# EAGLE design facewhisperer (EAGLE 6.6.0)
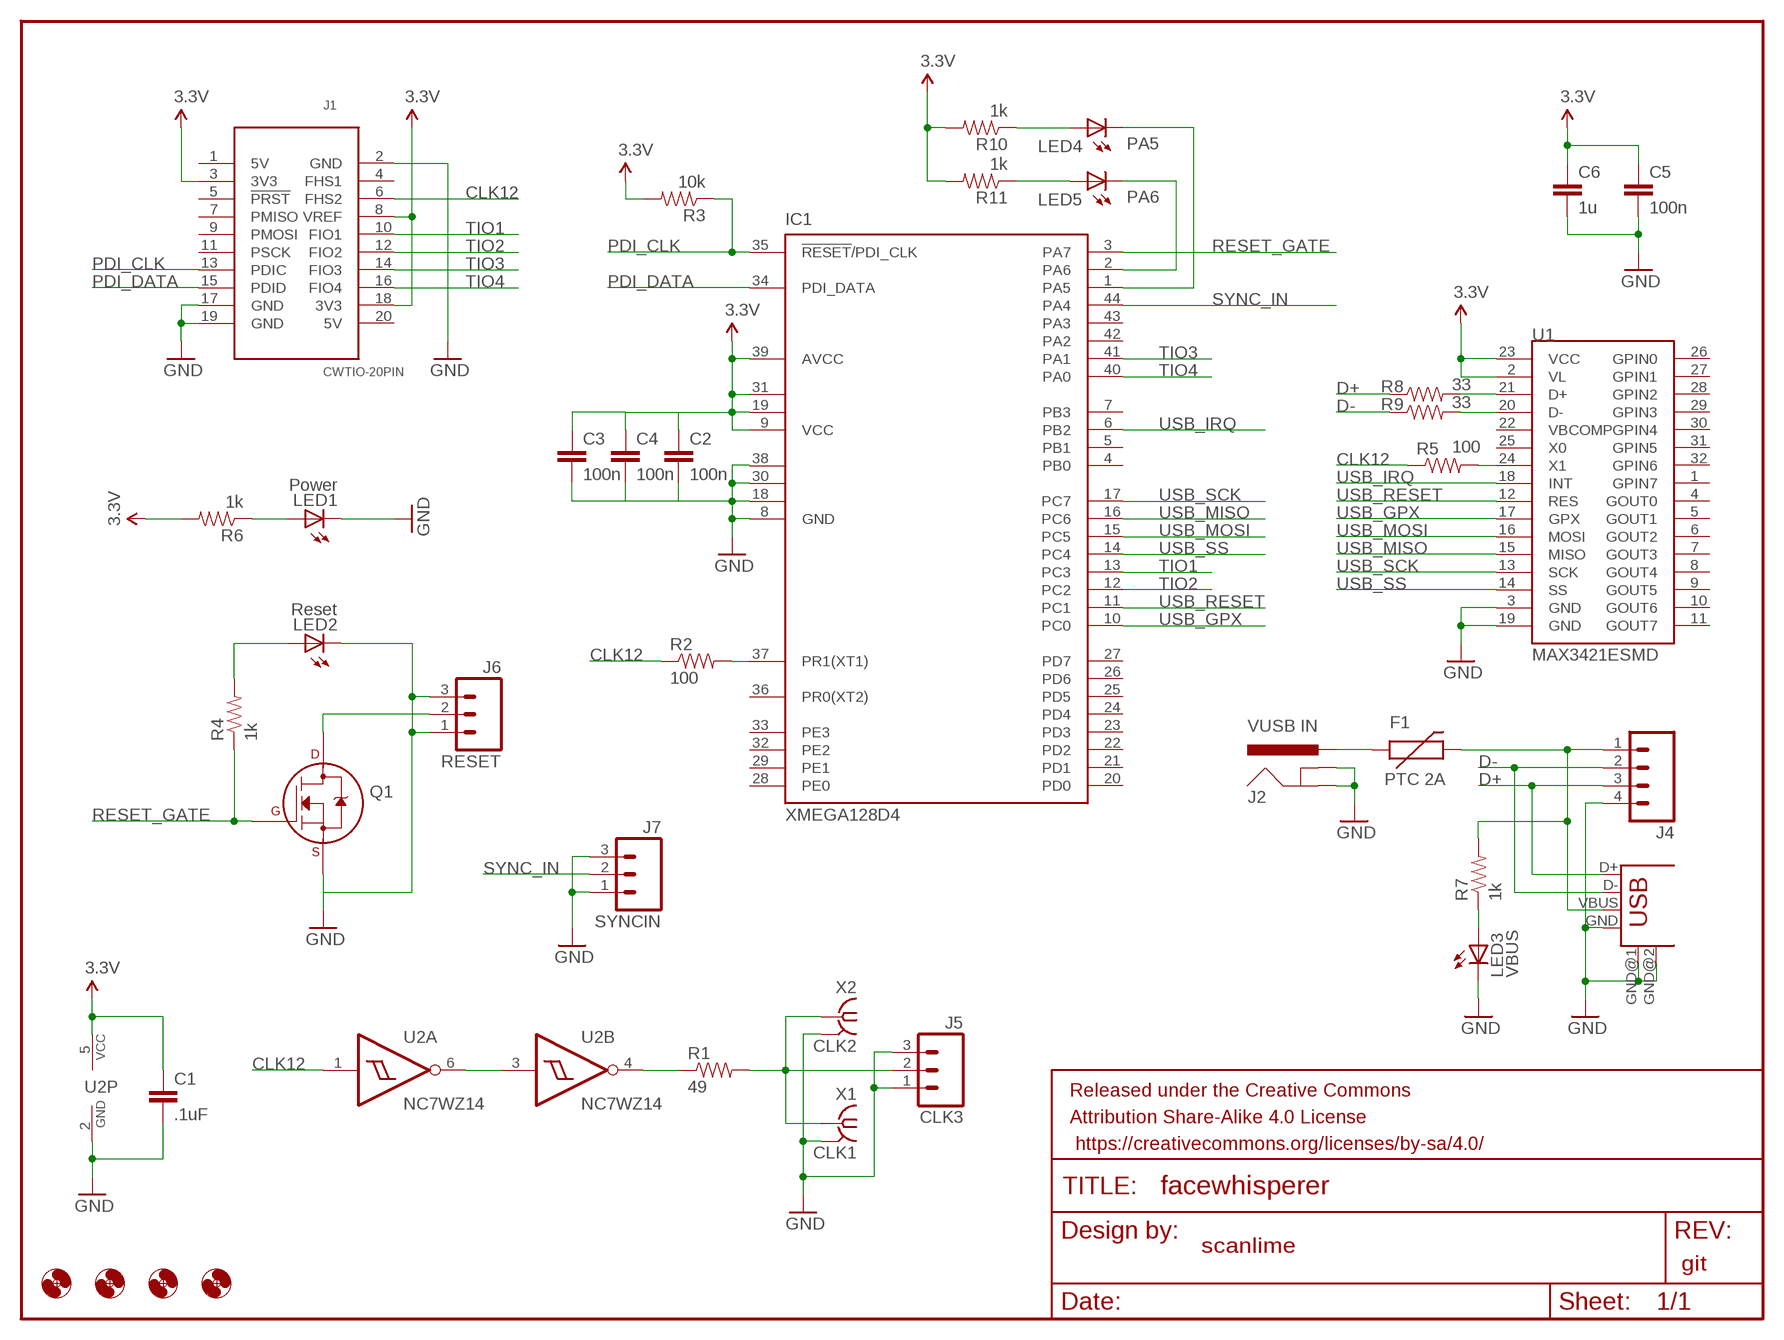
[diagram p0: schematic, sheet 1]

## Parts
C1  .1uF  CAP0805  [0805]
C2  100n  CAP0805  [0805]
C3  100n  CAP0805  [0805]
C4  100n  CAP0805  [0805]
C5  100n  CAP0805  [0805]
C6  1u  CAP0805  [0805]
F1  PTC 2A  PTCSMD-W  [PTC-1206-WIDE]
FRAME1  FRAME-LETTERNO_PACKAGE  [DUMMY]
H1  MOUNT-HOLE3.2  [3,2]
H2  MOUNT-HOLE3.2  [3,2]
H3  MOUNT-HOLE3.2  [3,2]
H4  MOUNT-HOLE3.2  [3,2]
IC1  XMEGA128D4  XMEGA16A4A  [TQFP44]
J1  CWTIO-20PIN  [PINSHRD_PTH_2X10]
J2  VUSB IN  POWER_JACKPTH  [POWER_JACK_PTH]
J3  USB-A-H  [USB-A-H]
J4  M04LOCK_LONGPADS  [1X04_LOCK_LONGPADS]
J5  CLK3  M03LOCK_LONGPADS  [1X03_LOCK_LONGPADS]
J6  RESET  M03LOCK_LONGPADS  [1X03_LOCK_LONGPADS]
J7  SYNCIN  M03LOCK_LONGPADS  [1X03_LOCK_LONGPADS]
LED1  Power  LEDSMT1206  [1206]
LED2  Reset  LEDSMT1206  [1206]
LED3  VBUS  LEDSMT1206  [1206]
LED4  PA5  LEDSMT1206  [1206]
LED5  PA6  LEDSMT1206  [1206]
Q1  2N7002_SOT23  [SOT-23]
R1  49  RESISTOR0805-RES  [0805]
R2  100  RESISTOR0805-RES  [0805]
R3  10k  RESISTOR0805-RES  [0805]
R4  1k  RESISTOR0805-RES  [0805]
R5  100  RESISTOR0805-RES  [0805]
R6  1k  RESISTOR0805-RES  [0805]
R7  1k  RESISTOR0805-RES  [0805]
R8  33  RESISTOR0805-RES  [0805]
R9  33  RESISTOR0805-RES  [0805]
R10  1k  RESISTOR0805-RES  [0805]
R11  1k  RESISTOR0805-RES  [0805]
U1  MAX3421ESMD  [TQFP32-5MM-MILLABLE]
U2  NC7WZ14  [SC70-6-MILLABLE]
X1  CLK1  SMA-NOSILK  [J502-ND-142-0711-821/826-NOSILK]
X2  CLK2  SMA-NOSILK  [J502-ND-142-0711-821/826-NOSILK]

## Nets
3.3V: C1.1 C2.1 C3.1 C4.1 C5.1 C6.1 IC1.9(VCC) IC1.19(VCC1) IC1.31(VCC2) IC1.39(AVCC) J1.3(3V3) J1.8(VREF) J1.18(3V3) R3.2 R6.2 R10.2 R11.2 U1.2(VL) U1.23(VCC) U2.5(P:VCC)
CLK12: J1.6(FHS2) R2.1 R5.1 U2.1(A:IN)
D+: J3.D+ J4.3 R8.1
D-: J3.D- J4.2 R9.1
GND: C1.2 C2.2 C3.2 C4.2 C5.2 C6.2 IC1.8(GND) IC1.18(GND1) IC1.30(GND2) IC1.38(GND3) J1.2(GND) J1.17(GND) J1.19(GND) J2.GND J2.GNDBREAK J3.GND J3.GND@1(GND) J3.GND@2(GND) J4.4 J5.1 J5.3 J6.1 J6.3 J7.1 J7.3 LED1.C LED2.C LED3.C Q1.2(S) U1.3(GND) U1.19(GND) U2.2(P:GND) X1.G@1 X1.G@2 X1.G@3 X1.G@4 X2.G@1 X2.G@2 X2.G@3 X2.G@4
N$1: U2.3(B:IN) U2.6(A:OUT)
N$2: R1.1 U2.4(B:OUT)
N$3: J5.2 R1.2 X1.1 X2.1
N$4: R5.2 U1.24(X1)
N$5: F1.2 J3.VBUS J4.1 R7.2
N$6: LED2.A R4.2
N$7: IC1.37(PR1(XT1)) R2.2
N$8: J6.2 Q1.3(D)
N$9: LED1.A R6.1
N$10: LED3.A R7.1
N$11: R9.2 U1.20(D-)
N$12: R8.2 U1.21(D+)
N$13: F1.1 J2.PWR
N$14: LED4.A R10.1
N$15: LED5.A R11.1
N$16: IC1.2(PA6) LED5.C
N$17: IC1.1(PA5) LED4.C
PDI_CLK: IC1.35(!RESET!/PDI_CLK) J1.13(PDIC) R3.1
PDI_DATA: IC1.34(PDI_DATA) J1.15(PDID)
RESET_GATE: IC1.3(PA7) Q1.1(G) R4.1
SYNC_IN: IC1.44(PA4) J7.2
TIO1: IC1.13(PC3) J1.10(FIO1)
TIO2: IC1.12(PC2) J1.12(FIO2)
TIO3: IC1.41(PA1) J1.14(FIO3)
TIO4: IC1.40(PA0) J1.16(FIO4)
USB_GPX: IC1.10(PC0) U1.17(GPX)
USB_IRQ: IC1.6(PB2) U1.18(INT)
USB_MISO: IC1.16(PC6) U1.15(MISO)
USB_MOSI: IC1.15(PC5) U1.16(MOSI)
USB_RESET: IC1.11(PC1) U1.12(RES)
USB_SCK: IC1.17(PC7) U1.13(SCK)
USB_SS: IC1.14(PC4) U1.14(SS)
Unconnected: IC1.4(PB0) IC1.5(PB1) IC1.7(PB3) IC1.20(PD0) IC1.21(PD1) IC1.22(PD2) IC1.23(PD3) IC1.24(PD4) IC1.25(PD5) IC1.26(PD6) IC1.27(PD7) IC1.28(PE0) IC1.29(PE1) IC1.32(PE2) IC1.33(PE3) IC1.36(PR0(XT2)) IC1.42(PA2) IC1.43(PA3) J1.1(5V) J1.4(FHS1) J1.5(!PRST) J1.7(PMISO) J1.9(PMOSI) J1.11(PSCK) J1.20(5V) U1.1(GPIN7) U1.4(GOUT0) U1.5(GOUT1) U1.6(GOUT2) U1.7(GOUT3) U1.8(GOUT4) U1.9(GOUT5) U1.10(GOUT6) U1.11(GOUT7) U1.22(VBCOMP) U1.25(X0) U1.26(GPIN0) U1.27(GPIN1) U1.28(GPIN2) U1.29(GPIN3) U1.30(GPIN4) U1.31(GPIN5) U1.32(GPIN6)

## Notes on the sheet
- scanlime
- git

## Library data of the parts
C1-C6 = SparkFun-Passives:CAP: Capacitor Standard 0603 ceramic capacitor, and 0.1" leaded capacitor.
F1 = SparkFun-PowerIC:PTC: Resettable Fuse PTC Resettable Fuse. Spark Fun Electronics SKU : COM-08357
FRAME1 = SparkFun-Aesthetics:FRAME-LETTER: Schematic Frame Standard 8.5x11 US Letter frame; DESIGNER: Nobody; VERSION: v01
H1-H4 = holes:MOUNT-HOLE: MOUNTING HOLE with drill center marker
IC1 = atmel:XMEGA16A4: MICROCONTROLLER Features High-performance, Low-power 8/16-bit AVR XMEGA Microcontroller Non-Volatile Program and Data Memories - 16 KB - 128 KB of In-System Self-Programmable Flash - 4 KB - 8 KB Boot Code Section with Independent Lock Bits - 1 KB - 2 KB EEPROM - 2 KB - 8 KB Internal SRAM Peripheral Features - Four-channel DMA Controller with support for external requests - Eight-channel Event System - Five 16-bit Timer/Counters Three Timer/Counters with 4 Output Compare or Input Capture channels Two Timer/Counters with 2 Output Compare or Input Capture channels High-Resolution Extensions on all Timer/Counters Advanced Waveform Extension on one Timer/Counter - Five USARTs IrDA Extension on one USART - Two Two-Wire Interfaces with dual address match (I2C and SMBus compatible) - Two SPIs (Serial Peripheral Interfaces) peripherals - AES and DES Crypto Engine - 16-bit Real Time Counter with Separate Oscillator - One Twelve-channel, 12-bit, 2 Msps Analog to Digital Converter - One Two-channel, 12-bit, 1 Msps Digital to Analog Converter - Two Analog Comparators with Window compare function - External Interrupts on all General Purpose I/O pins - Programmable Watchdog Timer with Separate On-chip Ultra Low Power Oscillator Special Microcontroller Features - Power-on Reset and Programmable Brown-out Detection - Internal and External Clock Options with PLL - Programmable Multi-level Interrupt Controller - Sleep Modes: Idle, Power-down, Standby, Power-save, Extended Standby - Advanced Programming, Test and Debugging Interfaces PDI (Program and Debug Interface) for programming, test and debugging I/O and Packages - 34 Programmable I/O Lines - 44 - lead TQFP - 44 - pad VQFN/QFN - 49 - ball VFBGA Operating Voltage - 1.6 - 3.6V Speed performance - 0 - 12 MHz @ 1.6 - 3.6V - 0 - 32 MHz @ 2.7 - 3.6V Drawn by Dipl.-Ing. (FH) Robert Siegler Created: 27.05.09; OC_FARNELL: unknown; OC_NEWARK: unknown
J1 = chipwhisperer:CWTIO-20PIN
J2 = SparkFun-Connectors:POWER_JACK: Power Jack This is the standard 5.5mm barrel jack for power. The PTH is the most common, proven, reliable, footprint. The Slot footprint only works if the mill layer is transmitted to the PCB fab house so be warned. Mating wall wart : TOL-00298 (and others); PROD_ID: CONN-08197
J3 = con-usb-2:USB: USB Connectors
J4 = SparkFun-Connectors:M04: Header 4 Standard 4-pin 0.1" header. Use with straight break away headers (SKU : PRT-00116), right angle break away headers (PRT-00553), swiss pins (PRT-00743), machine pins (PRT-00117), and female headers (PRT-00115). Molex polarized connector foot print use with SKU : PRT-08231 with associated crimp pins and housings. 1MM SMD Version SKU: PRT-10208; PROD_ID: CONN-09696
J5-J7 = SparkFun-Connectors:M03: Header 3 Standard 3-pin 0.1" header. Use with straight break away headers (SKU : PRT-00116), right angle break away headers (PRT-00553), swiss pins (PRT-00743), machine pins (PRT-00117), and female headers (PRT-00115). Molex polarized connector foot print use with SKU : PRT-08232 with associated crimp pins and housings.
LED1-LED5 = adafruit:LED: LED OSRAM: - CHIPLED LG R971, LG N971, LY N971, LG Q971, LY Q971, LO R971, LY R971 LH N974, LH R974 LS Q976, LO Q976, LY Q976 LO Q996 - Hyper CHIPLED LW Q18S LB Q993, LB Q99A, LB R99A - SideLED LS A670, LO A670, LY A670, LG A670, LP A670 LB A673, LV A673, LT A673, LW A673 LH A674 LY A675 LS A676, LA A676, LO A676, LY A676, LW A676 LS A679, LY A679, LG A679 - Hyper Micro SIDELED® LS Y876, LA Y876, LO Y876, LY Y876 LT Y87S - SmartLED LW L88C, LW L88S LB L89C, LB L89S, LG L890 LS L89K, LO L89K, LY L89K LS L896, LA L896, LO L896, LY L896 - TOPLED LS T670, LO T670, LY T670, LG T670, LP T670 LSG T670, LSP T670, LSY T670, LOP T670, LYG T670 LG T671, LOG T671, LSG T671 LB T673, LV T673, LT T673, LW T673 LH T674 LS T676, LA T676, LO T676, LY T676, LB T676, LH T676, LSB T676, LW T676 LB T67C, LV T67C, LT T67C, LS T67K, LO T67K, LY T67K, LW E67C LS E67B, LA E67B, LO E67B, LY E67B, LB E67C, LV E67C, LT E67C LW T67C LS T679, LY T679, LG T679 LS T770, LO T770, LY T770, LG T770, LP T770 LB T773, LV T773, LT T773, LW T773 LH T774 LS E675, LA E675, LY E675, LS T675 LS T776, LA T776, LO T776, LY T776, LB T776 LHGB T686 LT T68C, LB T68C - Hyper Mini TOPLED® LB M676 - Mini TOPLED Santana® LG M470 LS M47K, LO M47K, LY M47K Source: http://www.osram.convergy.de/
Q1 = transistors:2N700*: 2N7000, 2N7002, NDS7002A N-channel enhancement mode MOSFET
R1-R11 = SparkFun-Passives:RESISTOR: Resistor Basic schematic elements and footprints for 0603, 1206, and PTH resistors.
U1 = SparkFun-DigitalIC:MAX3421E: USB Peripheral/Host Controller w/ SPI
U2 = fairchild-semi:NC7WZ14: UHS Dual Inverter with Schmitt Trigger
X1 X2 = custom-std:SMA-: SMA 50 Ohm End Launch Jack Receptacle - Round Contact Johnson Components Source: www.johnsoncomponents.com .. J502-ND.pdf

## Board
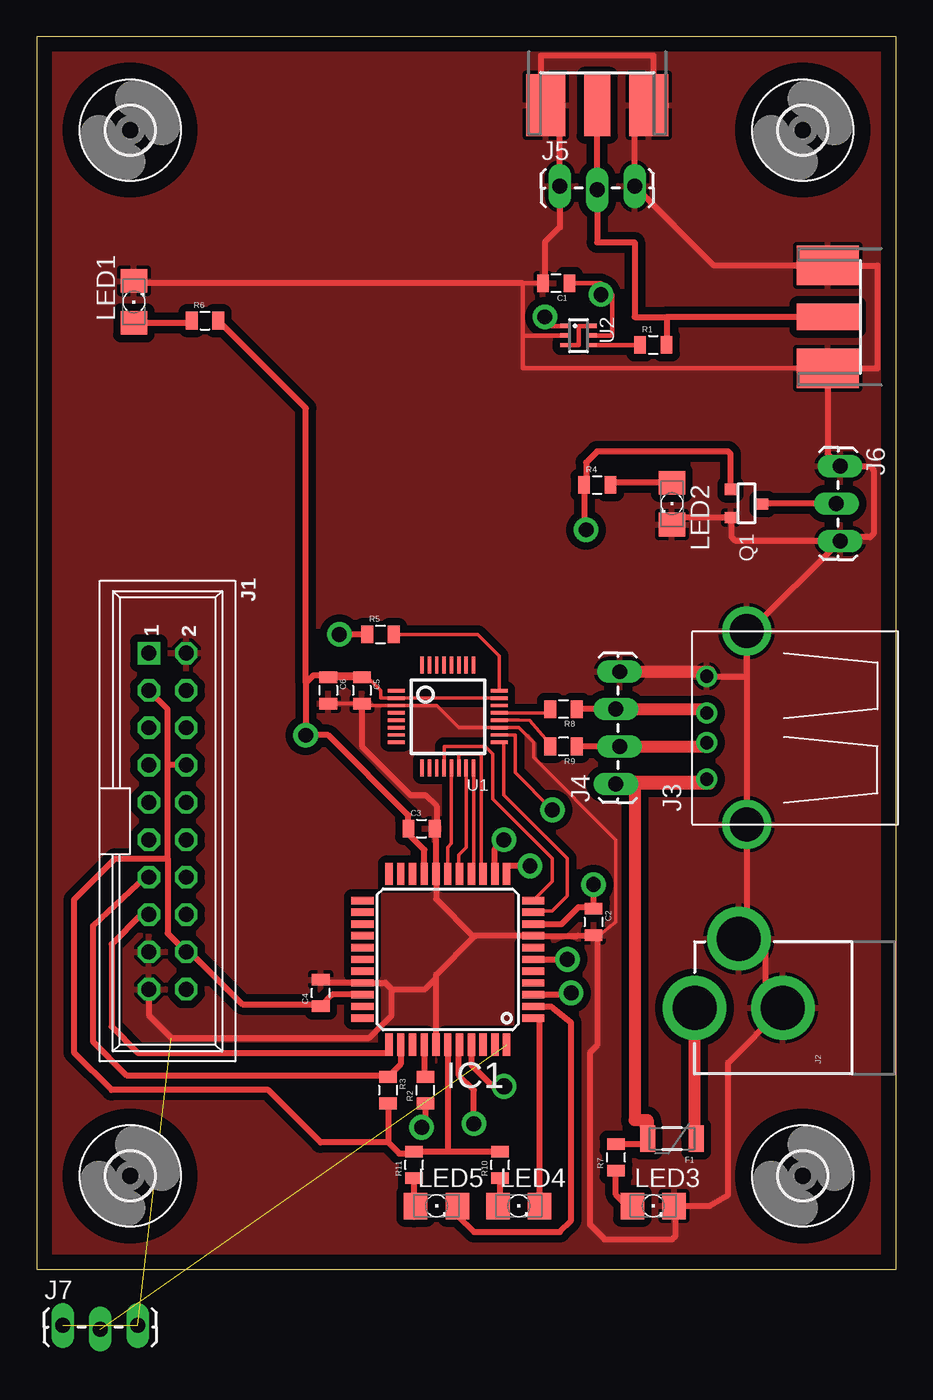
[diagram p1: board, top side]
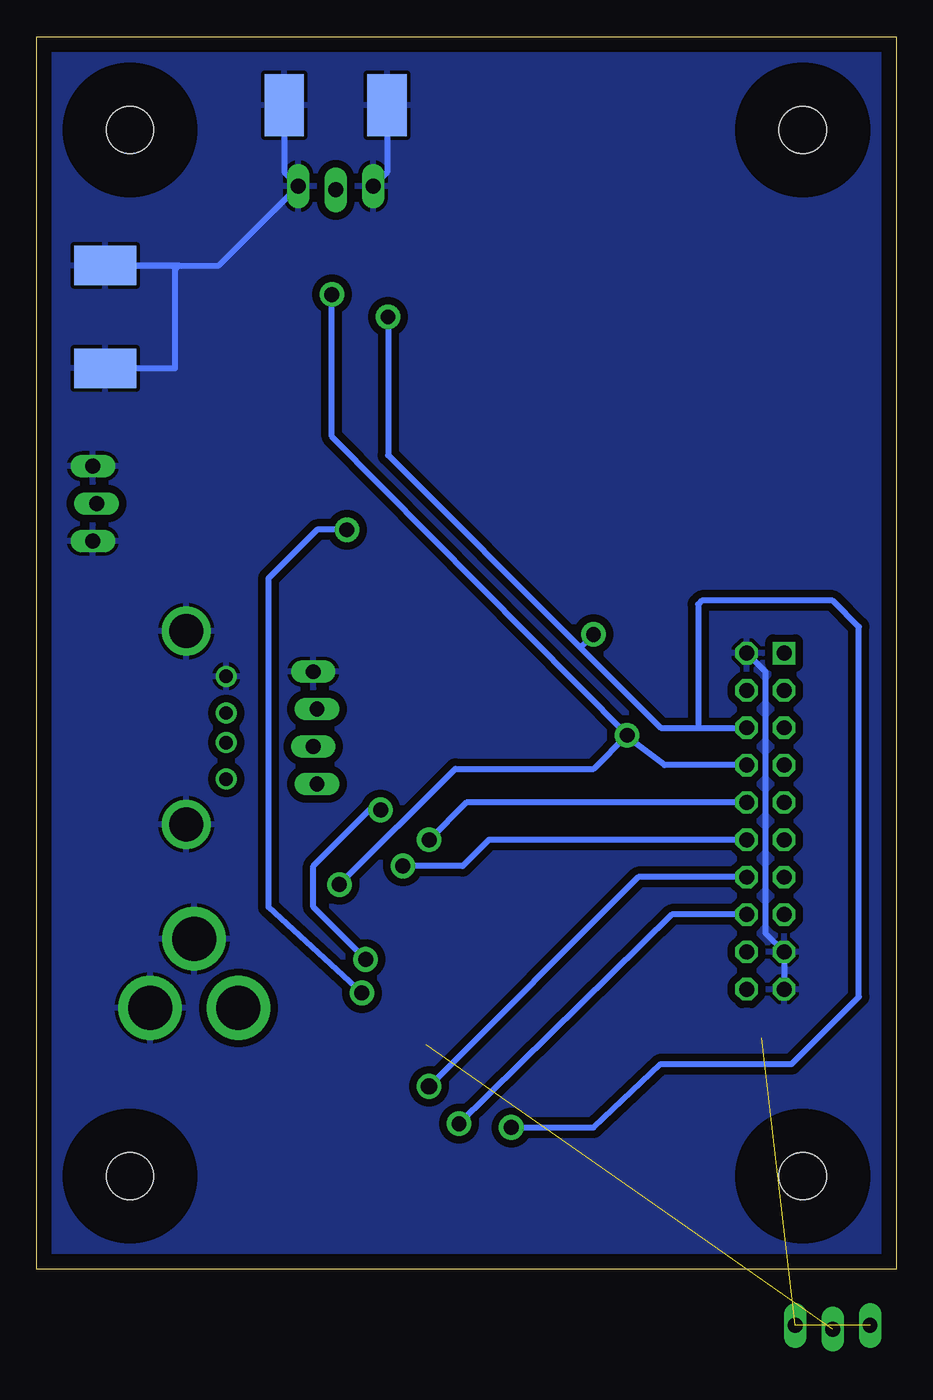
[diagram p2: board, bottom side, seen from below]

Size 58.42 x 83.82 mm. Coordinates in mm from the lower left corner, seen from the top.
Outline: 0,0 58.42,0 58.42,83.82 0,83.82 0,0
Copper layers (1*16): Top 0.035mm / dielectric 1.5mm / Bottom 0.035mm
Design rules "default *": minimum track width 8mil, minimum drill 35mil, track to track 10mil, track to pad 10mil, pad to pad 10mil, via to via 10mil, smd to smd 10mil, copper to edge 40mil, drill to drill 10mil, minimum pad ring 10mil, minimum via ring 8mil, stop-mask expansion 8mil, vias tented up to drill 0mil, thermal gap 10mil

### Footprints (pad centres in the part's own frame; a part is rotated, then mirrored left to right if it is on the bottom)
0805 = smd 0.8 x 1.2: 1 -0.9,0; 2 0.9,0
PTC-1206-WIDE = smd 1 x 1.8: 1 -1.654,0; 2 1.654,0
3,2 = hole 3.2: 0,0
TQFP44 = smd 1.5 x 0.5: 1 -5.8,4; 2 -5.8,3.2; 3 -5.8,2.4; 4 -5.8,1.6; 5 -5.8,0.8; 6 -5.8,0; 7 -5.8,-0.8; 8 -5.8,-1.6; 9 -5.8,-2.4; 10 -5.8,-3.2; 11 -5.8,-4; 23 5.8,-4; 24 5.8,-3.2; 25 5.8,-2.4; 26 5.8,-1.6; 27 5.8,-0.8; 28 5.8,0; 29 5.8,0.8; 30 5.8,1.6; 31 5.8,2.4; 32 5.8,3.2; 33 5.8,4 | smd 0.5 x 1.5: 12 -4,-5.8; 13 -3.2,-5.8; 14 -2.4,-5.8; 15 -1.6,-5.8; 16 -0.8,-5.8; 17 0,-5.8; 18 0.8,-5.8; 19 1.6,-5.8; 20 2.4,-5.8; 21 3.2,-5.8; 22 4,-5.8; 34 4,5.8; 35 3.2,5.8; 36 2.4,5.8; 37 1.6,5.8; 38 0.8,5.8; 39 0,5.8; 40 -0.8,5.8; 41 -1.6,5.8; 42 -2.4,5.8; 43 -3.2,5.8; 44 -4,5.8
PINSHRD_PTH_2X10 = drill 1.016 square: 1 -11.43,-1.27 | drill 1.016 octagon: 2 -11.43,1.27; 3 -8.89,-1.27; 4 -8.89,1.27; 5 -6.35,-1.27; 6 -6.35,1.27; 7 -3.81,-1.27; 8 -3.81,1.27; 9 -1.27,-1.27; 10 -1.27,1.27; 11 1.27,-1.27; 12 1.27,1.27; 13 3.81,-1.27; 14 3.81,1.27; 15 6.35,-1.27; 16 6.35,1.27; 17 8.89,-1.27; 18 8.89,1.27; 19 11.43,-1.27; 20 11.43,1.27
POWER_JACK_PTH = drill 2.997 pad 4.318: GND 0,7.7; GNDBREAK 4.7,10.7; PWR 0,13.7
USB-A-H = drill 0.914: D+ 2.718,-1.003; D- 2.718,1.003; GND 2.718,-3.493; VBUS 2.718,3.493 | drill 2.311: GND@1 0,6.566; GND@2 0,-6.566
1X04_LOCK_LONGPADS = drill 1.016 long: 1 0,0; 2 2.54,-0.254; 3 5.08,0; 4 7.62,-0.254
1X03_LOCK_LONGPADS = drill 1.016 long: 1 0,0; 2 2.54,-0.254; 3 5.08,0
1206 = smd 1.6 x 1.803: A -1.422,0; C 1.422,0
SOT-23 = smd 0.762 x 0.762: 1 -0.979,-1.101; 2 0.94,-1.101; 3 0.025,1.067
TQFP32-5MM-MILLABLE = smd 1.143 x 0.229: 1 -3.5,1.75; 2 -3.5,1.25; 3 -3.5,0.75; 4 -3.5,0.25; 5 -3.5,-0.25; 6 -3.5,-0.75; 7 -3.5,-1.25; 8 -3.5,-1.75; 17 3.5,-1.75; 18 3.5,-1.25; 19 3.5,-0.75; 20 3.5,-0.25; 21 3.5,0.25; 22 3.5,0.75; 23 3.5,1.25; 24 3.5,1.75 | smd 0.229 x 1.143: 9 -1.75,-3.5; 10 -1.25,-3.5; 11 -0.75,-3.5; 12 -0.25,-3.5; 13 0.25,-3.5; 14 0.75,-3.5; 15 1.25,-3.5; 16 1.75,-3.5; 25 1.75,3.5; 26 1.25,3.5; 27 0.75,3.5; 28 0.25,3.5; 29 -0.25,3.5; 30 -0.75,3.5; 31 -1.25,3.5; 32 -1.75,3.5
SC70-6-MILLABLE = smd 0.305 x 0.6: 1 -0.65,-0.95; 2 0,-0.95; 3 0.65,-0.95; 4 0.65,0.95; 5 0,0.95; 6 -0.65,0.95
J502-ND-142-0711-821/826-NOSILK = smd 4.191 x 1.778: 1 2.115,0 | smd 4.191 x 2.667: G@1 2.115,3.495; G@2 2.115,-3.495 | smd 4.191 x 2.667 bottom: G@3 2.115,3.495; G@4 2.115,-3.495

### Placement (x,y rotation side)
C1  35.31,67.06 180 top
C2  37.85,23.62 270 top
C3  26.16,29.97 0 top
C4  19.3,18.8 90 top
C5  22.1,39.37 270 top
C6  19.81,39.37 270 top
F1  43.18,8.89 180 top
FRAME1  44.45,58.42 0 top
H1  6.35,6.35 0 top
H2  52.07,77.47 0 top
H3  52.07,6.35 0 top
H4  6.35,77.47 0 top
IC1  27.94,21.08 180 top
J1  8.89,30.48 270 top
J2  58.42,17.78 90 top
J3  48.26,36.83 180 top
J4  39.37,33.02 90 top
J5  35.56,73.66 0 top
J6  54.61,54.61 270 top
J7  1.78,-3.81 0 top  (outside the outline)
LED1  6.6,65.79 90 top
LED2  43.18,52.07 270 top
LED3  41.91,4.32 0 top
LED4  32.77,4.32 0 top
LED5  27.18,4.32 0 top
Q1  48.26,52.07 270 top
R1  41.91,62.87 0 top
R2  26.42,12.19 90 top
R3  23.88,12.19 270 top
R4  38.1,53.34 0 top
R5  23.37,43.18 0 top
R6  11.43,64.52 0 top
R7  39.37,7.62 90 top
R8  35.81,38.1 180 top
R9  35.81,35.56 180 top
R10  31.5,7.11 90 top
R11  25.65,7.11 90 top
U1  27.94,37.59 0 top
U2  36.83,63.5 270 top
X1  55.88,64.77 180 top
X2  38.1,81.28 270 top

### Tracks (layer width: path | path; a pad name or v marks a point on that pad's centre or on a via)
3.3V  (via drill 1.02 pad 1.68)
  Top 0.229: U1.23 U1.2 23.39,38.84 23.37,38.86 23.37,39.37 22.61,40.13 22.24,40.13 C5.1 C6.1
  Top 0.305: 38.35,67.06 C1.1 | U2.5 39.12,63.5 39.12,66.29 38.35,67.06 | 38.35,67.06 v38.35,66.29
  Top 0.406: IC1.9 35.67,23.48 36.83,24.64 37.71,24.64 C2.1 | IC1.31 20.09,18.68 C4.1 19.17,18.03 13.97,18.03 10.41,21.59 J1.18 8.89,22.86 8.89,27.94 | IC1.19 26.34,28.52 25.4,29.46 25.4,29.83 C3.1 25.26,30.87 19.8,36.33 18.3,36.33 v18.29,36.32 18.29,39.88 | 23.88,8.64 R3.2 24.01,11.43 | 23.88,8.64 24.64,7.87 25.54,7.87 R11.2 27.94,8.01 | 27.94,8.01 R10.2 | C6.1 21.98,40.27 22.1,40.39 18.8,40.39 18.29,39.88 | C2.1 37.85,24.38 | C2.1 v37.85,26.16 | IC1.39 27.94,8.01 | 23.88,8.64 19.3,8.64 15.75,12.19 5.08,12.19 2.54,14.73 2.54,25.15 5.33,27.94 8.89,27.94 | 18.29,39.88 18.29,58.56 R6.2 | 8.89,27.94 8.89,34.29 | 8.89,34.29 8.89,38.1 J1.3 | J1.8 8.89,34.29
  Bottom 0.406: v38.35,66.29 38.35,56.64 18.28,36.33 v18.29,36.32 | J1.3 7.87,39.37 | J1.8 15.75,34.29 17.78,35.81 v18.29,36.32 | v37.85,26.16 29.97,34.04 20.57,34.04 v18.29,36.32
CLK12  (via drill 1.02 pad 1.68)
  Top 0.305: U2.1 34.29,64.15 v34.54,64.77
  Top 0.406: R2.1 26.42,9.91 v26.16,9.65 | R5.1 v20.57,43.18
  Bottom 0.406: v34.54,64.77 34.54,55.37 21.46,42.29 | 21.46,42.29 16,36.83 13.46,36.83 | 13.46,36.83 J1.6 | v26.16,9.65 20.57,9.65 16,13.97 7.11,13.97 2.54,18.54 2.54,43.69 4.32,45.47 13.21,45.47 13.46,45.21 13.46,36.83 | v20.57,43.18 21.46,42.29
D+
  Top 0.406: J3.D+ 45.72,37.83 45.72,38.1 | J4.3 R8.1
  Top 0.813: J4.3 45.72,38.1
D-
  Top 0.406: J3.D- 45.72,35.83 45.72,35.56 | J4.2 R9.1
  Top 0.813: J4.2 45.72,35.56
GND  (2 unrouted)
  Top 0.229: C6.2 C5.2 22.23,38.34 U1.3 27.19,38.34 28.69,36.84 U1.19 32.75,36.84 33.78,35.81 33.78,34.8 39.37,29.21 39.37,23.62 38.1,22.61 36.58,22.61
  Top 0.305: C1.2 33.02,67.06 33.02,63.5 | 33.02,63.5 U2.2 | X1.G@3 33.02,61.27 33.02,63.5
  Top 0.406: J2.GNDBREAK 48.26,22.48 | 48.26,22.48 49.53,22.48 49.53,17.78 J2.GND 46.99,14.05 46.99,5.08 45.72,4.32 LED3.C 43.43,3.71 43.43,2.29 43.18,2.03 38.61,2.03 37.59,3.05 37.59,14.73 38.1,15.24 38.1,22.61 | 48.26,22.48 J3.GND@1 J3.GND@2 | J3.GND@2 48.26,40.32 J3.GND 45.72,40.32 45.72,40.64 | X2.G@3 40.64,79.48 J5.3 46.03,68.27 X1.G@4 57.15,68.27 57.15,61.27 X1.G@3 53.77,55.45 J6.1 56.64,54.61 56.9,54.36 56.9,50.04 56.64,49.78 54.86,49.78 J6.3 | 41.91,78.74 41.91,82.55 34.29,82.55 34.29,79.17 X2.G@4 35.56,79.48 J5.1 35.56,70.87 34.54,69.85 34.54,67.19 C1.2 | C2.2 36.79,22.68 IC1.8 29.79,22.68 29.72,22.61 | C4.2 19.09,19.48 IC1.30 23.7,19.48 24.13,19.05 | C5.2 22.1,35.56 25.4,32.26 26.42,32.26 27.18,31.5 27.18,30.09 C3.2 27.14,29.13 IC1.18 27.14,25.18 29.72,22.61 | J1.19 7.62,17.27 9.14,15.75 22.61,15.75 24.13,17.27 24.13,19.05 | LED2.C 43.66,51.13 Q1.2 47.24,51.05 47.24,49.78 47.5,49.53 J6.3 | J3.GND@2 48.48,43.4 J6.3 | IC1.38 27.14,19.81 | 27.14,19.81 27.14,20.03 29.72,22.61 | 24.13,19.05 26.38,19.05 27.14,19.81 | 33.02,67.06 6.76,67.06 LED1.C
  Top 0.813: J4.4 45.72,40.64
  Bottom 0.406: J1.19 J1.17 8.89,22.86 8.89,40.64 J1.2 | X1.G@3 49.02,61.27 49.02,68.01 48.77,68.27 X1.G@4 46.03,68.27 J5.3 41.59,74.61 X2.G@3 | X2.G@4 34.6,74.61 J5.1
  pour Bottom (isolate 0.508): 0,83.82 58.42,83.82 58.42,0 0,0
  pour Top (isolate 0.508): 0,83.82 58.42,83.82 58.42,0 0,0
N$1
  Top 0.305: U2.6 36.83,64.15 36.83,62.85 U2.3
N$2
  Top 0.305: U2.4 41.01,62.85 R1.1
N$3
  Top 0.406: X2.1 J5.2 38.1,69.85 40.64,69.85 40.64,64.77 42.81,64.77 | X1.1 42.81,64.77 | 42.81,64.77 R1.2
N$4
  Top 0.229: U1.24 31.44,41.71 29.97,43.18 R5.2
N$5
  Top 0.406: J3.VBUS 39.37,33.34 J4.1 | 41.16,9.79 41.53,10.16 | R7.2 41.16,8.52 F1.2
  Top 0.813: 45.72,33.02 J4.1 40.64,33.02 40.64,10.16 41.53,10.16 F1.2
N$6
  Top 0.406: LED2.A 39.15,53.49 R4.2
N$7
  Top 0.406: IC1.37 26.34,13.17 R2.2
N$8
  Top 0.406: J6.2 49.35,52.07 Q1.3
N$9
  Top 0.406: LED1.A 10.38,64.36 R6.1
N$10
  Top 0.406: LED3.A 40.49,3.96 39.37,5.08 R7.1
N$11
  Top 0.229: U1.20 32.76,37.34 33.53,37.34 34.8,35.81 34.8,35.56 R9.2
N$12
  Top 0.229: U1.21 34.66,37.84 R8.2
N$13
  Top 0.406: F1.1 44.72,8.89
  Top 0.813: 44.72,8.89 J2.PWR
N$14
  Top 0.406: LED4.A 31.5,4.06 R10.1
N$15
  Top 0.406: LED5.A 25.65,3.56 R11.1
N$16
  Top 0.406: IC1.2 34.95,17.88 36.32,16.76 36.32,3.3 35.56,2.54 29.72,2.54 28.6,3.66 LED5.C
N$17
  Top 0.406: LED4.C 34.19,16.92 34.29,17.02 33.8,17.02 IC1.1
PDI_CLK
  Top 0.406: IC1.35 24.74,13.96 R3.1 23.74,13.21 6.1,13.21 3.81,15.49 3.81,23.37 7.37,26.67 J1.13
PDI_DATA
  Top 0.406: J1.15 7.11,24.13 5.08,22.1 5.08,16.51 6.86,14.73 23.9,14.73 IC1.34
RESET_GATE  (via drill 1.02 pad 1.68)
  Top 0.406: Q1.1 47.16,55.46 46.99,55.63 38.1,55.63 37.34,54.86 37.34,53.48 R4.1 37.2,50.43 v37.34,50.29 | IC1.3 35.45,18.68 v36.32,18.8
  Bottom 0.406: v37.34,50.29 39.37,50.29 42.67,46.99 42.67,24.64 v36.32,18.8
SYNC_IN  (1 unrouted)
TIO1  (via drill 1.02 pad 1.68)
  Top 0.406: v31.75,29.21 31.14,28.6 IC1.13
  Bottom 0.406: J1.10 29.21,31.75 v31.75,29.21
TIO2  (via drill 1.02 pad 1.68)
  Top 0.406: v33.53,27.43 31.98,27.43 IC1.12
  Bottom 0.406: J1.12 27.69,29.21 29.46,27.43 v33.53,27.43
TIO3  (via drill 1.12 pad 1.68)
  Top 0.406: v31.75,12.45 30.99,12.45 29.54,13.89 IC1.41
  Bottom 0.406: J1.14 17.53,26.67 v31.75,12.45
TIO4  (via drill 1.02 pad 1.68)
  Top 0.406: v29.72,9.91 29.72,12.19 28.7,13.21 28.7,15.24 IC1.40
  Bottom 0.406: J1.16 15.24,24.13 v29.72,9.91
USB_GPX
  Top 0.229: U1.17 31.72,35.84 31.75,35.81 31.75,32.26 36.07,27.94 36.07,25.4 35.05,24.38 33.84,24.38 IC1.10
USB_IRQ  (via drill 1.02 pad 1.68)
  Top 0.229: U1.18 32.49,36.34 32.51,36.32 32.51,33.78 v35.05,31.24
  Top 0.406: IC1.6 v36.07,21.08
  Bottom 0.229: v35.05,31.24 35.81,31.24
  Bottom 0.406: v36.07,21.08 39.62,24.64 39.62,27.43 35.81,31.24
USB_MISO
  Top 0.229: U1.15 29.19,28.68 28.7,28.19 28.7,26.92 IC1.16
USB_MOSI
  Top 0.229: U1.16 29.69,27.15 29.46,26.92 29.46,26.96 IC1.15
USB_RESET
  Top 0.229: U1.12 27.69,35.56 30.48,35.56 30.99,35.05 30.99,32 35.05,27.94 35.05,26.39 IC1.11
USB_SCK
  Top 0.229: U1.13 28.19,28.95 27.94,28.7 IC1.17
USB_SS
  Top 0.229: U1.14 28.69,35.04 28.7,35.05 30.23,35.05 30.23,27 IC1.14